# EAGLE schematic axiom_beta_plugin_module_1xHDMI_in_v0.1.a3395842 (EAGLE 7.7.0)
Assembly variants: Beta
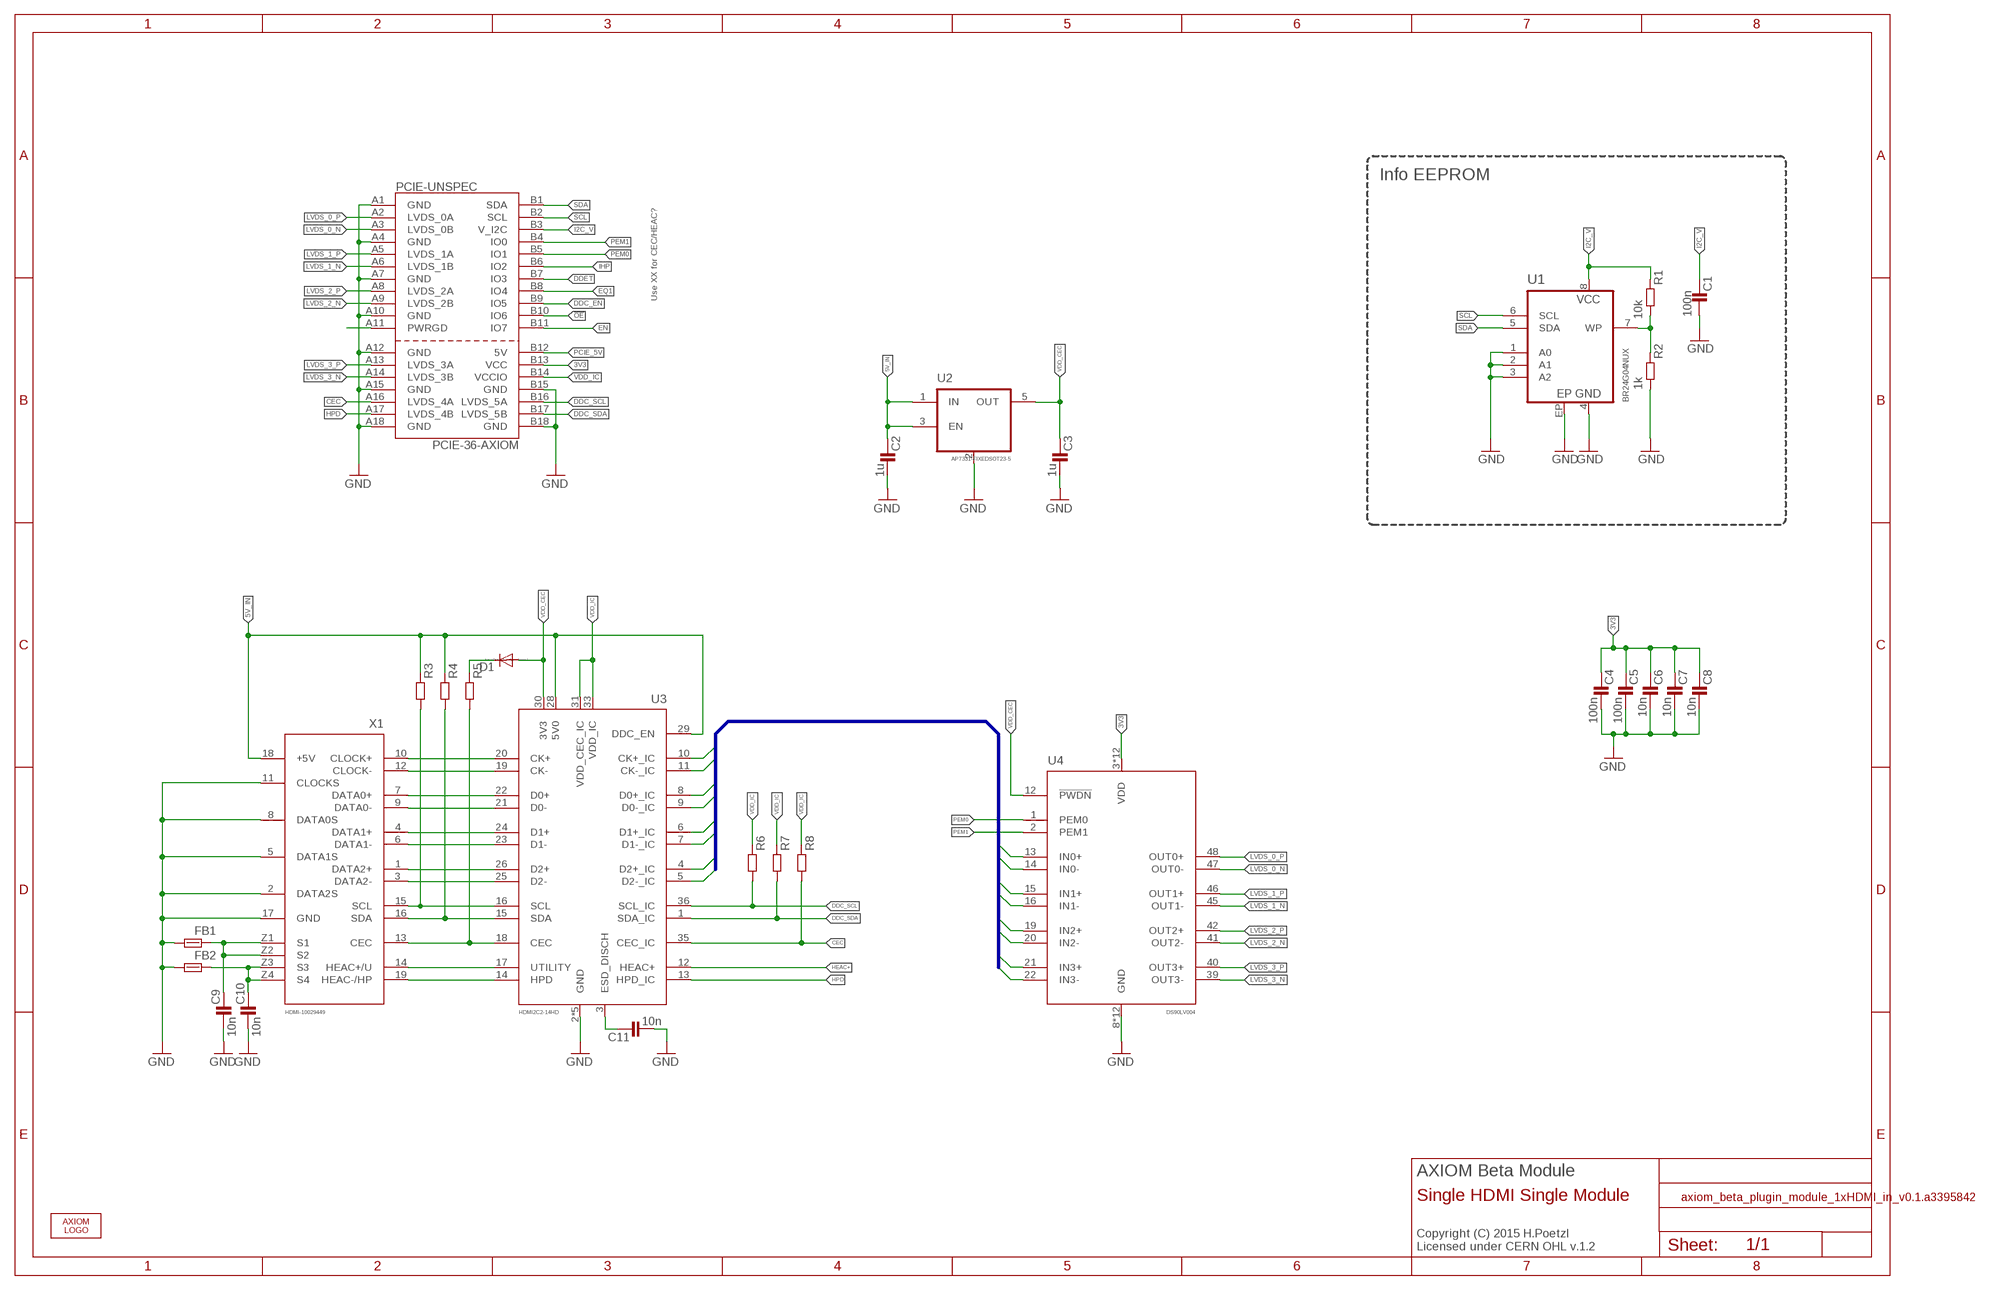
[diagram p0: schematic, sheet 1]

## Parts
C1  100n  C0402-B  [0402-B]
C2  1u  C0402-B  [0402-B]
C3  1u  C0402-B  [0402-B]
C4  100n  C0402-B  [0402-B]
C5  100n  C0402-B  [0402-B]
C6  10n  C0402-B  [0402-B]
C7  10n  C0402-B  [0402-B]
C8  10n  C0402-B  [0402-B]
C9  10n  C0402-B  [0402-B]
C10  10n  C0402-B  [0402-B]
C11  10n  C0402-B  [0402-B]
D1  DIODE-SOD523  [SOD523]
FB1  FB0603-B  [0603-B]
FB2  FB0603-B  [0603-B]
PCIE-UNSPEC  PCIE-36-AXIOM  [PCIE-36-AXIOM]  (not fitted in variant Beta)
R1  10k  R0402-B  [0402-B]
R2  1k  R0402-B  [0402-B]
R3  R0402-B  [0402-B]
R4  R0402-B  [0402-B]
R5  R0402-B  [0402-B]
R6  R0402-B  [0402-B]
R7  R0402-B  [0402-B]
R8  R0402-B  [0402-B]
U1  BR24G04NUX  [DFN200X300X100-9N]
U2  AP7331-FIXEDSOT23-5  [SOT23-5]
U3  HDMI2C2-14HD  [QFN50P650L90W-25N]
U4  DS90LV004  [QFP50P900X900X160-48N]
U$  AXIOM_LOGO459X70  [AXIOM_LOGO_459X70]
X1  HDMI-10029449  [10029449-X01XLF]

## Nets
3V3: C4.1 C5.1 C6.1 C7.1 C8.1 PCIE-UNSPEC.B13(VCC) U4.3(VDD) U4.4(VDD) U4.5(VDD) U4.7(VDD) U4.10(VDD) U4.11(VDD) U4.27(VDD) U4.28(VDD) U4.29(VDD) U4.32(VDD) U4.33(VDD) U4.34(VDD)
5V_IN: C2.1 R3.1 R4.1 U2.1(IN) U2.3(EN) U3.28(5V0) U3.29(DDC_EN) X1.18(+5V)
!OE!: PCIE-UNSPEC.B10(IO6)
CEC: PCIE-UNSPEC.A16(LVDS_4A) R8.2 U3.35(CEC_IC)
CK+: U3.20(CK+) X1.10(CLOCK+)
CK-: U3.19(CK-) X1.12(CLOCK-)
D0+: U3.22(D0+) X1.7(DATA0+)
D0-: U3.21(D0-) X1.9(DATA0-)
D1+: U3.24(D1+) X1.4(DATA1+)
D1-: U3.23(D1-) X1.6(DATA1-)
D2+: U3.26(D2+) X1.1(DATA2+)
D2-: U3.25(D2-) X1.3(DATA2-)
DDC_EN: PCIE-UNSPEC.B9(IO5)
DDC_SCL: PCIE-UNSPEC.B16(LVDS_5A) R6.2 U3.36(SCL_IC)
DDC_SDA: PCIE-UNSPEC.B17(LVDS_5B) R7.2 U3.1(SDA_IC)
DDET: PCIE-UNSPEC.B7(IO3)
EN: PCIE-UNSPEC.B11(IO7)
EQ1: PCIE-UNSPEC.B8(IO4)
GND: C1.2 C2.2 C3.2 C4.2 C5.2 C6.2 C7.2 C8.2 C9.2 C10.2 C11.2 FB1.2 FB2.2 PCIE-UNSPEC.A1(GND) PCIE-UNSPEC.A4(GND) PCIE-UNSPEC.A7(GND) PCIE-UNSPEC.A10(GND) PCIE-UNSPEC.A12(GND) PCIE-UNSPEC.A15(GND) PCIE-UNSPEC.A18(GND) PCIE-UNSPEC.B15(GND) PCIE-UNSPEC.B18(GND) R2.2 U1.1(A0) U1.2(A1) U1.3(A2) U1.4(GND) U1.EP U2.2(GND) U3.2(GND) U3.27(GND) U3.32(GND) U3.34(GND) U3.EP(GND) U4.8(GND) U4.9(GND) U4.17(GND) U4.18(GND) U4.23(GND) U4.24(GND) U4.25(GND) U4.26(GND) U4.37(GND) U4.38(GND) U4.43(GND) U4.44(GND) X1.2(DATA2S) X1.5(DATA1S) X1.8(DATA0S) X1.11(CLOCKS) X1.17(GND)
HEAC+: U3.12(HEAC+)
HPD: PCIE-UNSPEC.A17(LVDS_4B) U3.13(HPD_IC)
I2C_V: C1.1 PCIE-UNSPEC.B3(V_I2C) R1.1 U1.8(VCC)
IHP: PCIE-UNSPEC.B6(IO2)
IN0+: U3.4(D2+_IC) U4.13(IN0+)
IN0-: U3.5(D2-_IC) U4.14(IN0-)
IN1+: U3.6(D1+_IC) U4.15(IN1+)
IN1-: U3.7(D1-_IC) U4.16(IN1-)
IN2+: U3.8(D0+_IC) U4.19(IN2+)
IN2-: U3.9(D0-_IC) U4.20(IN2-)
IN3+: U3.10(CK+_IC) U4.21(IN3+)
IN3-: U3.11(CK-_IC) U4.22(IN3-)
LVDS_0_N: PCIE-UNSPEC.A3(LVDS_0B) U4.47(OUT0-)
LVDS_0_P: PCIE-UNSPEC.A2(LVDS_0A) U4.48(OUT0+)
LVDS_1_N [power]: PCIE-UNSPEC.A6(LVDS_1B) U4.45(OUT1-)
LVDS_1_P [power]: PCIE-UNSPEC.A5(LVDS_1A) U4.46(OUT1+)
LVDS_2_N [power]: PCIE-UNSPEC.A9(LVDS_2B) U4.41(OUT2-)
LVDS_2_P [power]: PCIE-UNSPEC.A8(LVDS_2A) U4.42(OUT2+)
LVDS_3_N [power]: PCIE-UNSPEC.A14(LVDS_3B) U4.39(OUT3-)
LVDS_3_P [power]: PCIE-UNSPEC.A13(LVDS_3A) U4.40(OUT3+)
N$1: R3.2 U3.16(SCL) X1.15(SCL)
N$2: R4.2 U3.15(SDA) X1.16(SDA)
N$3: R5.2 U3.18(CEC) X1.13(CEC)
N$4: U3.17(UTILITY) X1.14(HEAC+/U)
N$5: U3.14(HPD) X1.19(HEAC-/HP)
N$6: C9.1 FB1.1 X1.Z1(S1) X1.Z2(S2)
N$12: R1.2 R2.1 U1.7(WP)
N$15: C10.1 FB2.1 X1.Z3(S3) X1.Z4(S4)
N$17: D1.C R5.1
N$19: C11.1 U3.3(ESD_DISCH)
N$209: PCIE-UNSPEC.A11(PWRGD)
PCIE_5V: PCIE-UNSPEC.B12(5V)
PEM0: PCIE-UNSPEC.B5(IO1) U4.1(PEM0)
PEM1: PCIE-UNSPEC.B4(IO0) U4.2(PEM1)
SCL: PCIE-UNSPEC.B2(SCL) U1.6(SCL)
SDA: PCIE-UNSPEC.B1(SDA) U1.5(SDA)
VDD_CEC: C3.1 D1.A U2.5(OUT) U3.30(3V3) U4.12(!PWDN)
VDD_IC: PCIE-UNSPEC.B14(VCCIO) R6.1 R7.1 R8.1 U3.31(VDD_CEC_IC) U3.33(VDD_IC)

## Buses
IN:IN0+,IN0-,IN1+,IN1-,IN2+,IN2-,IN3+,IN3-

## Notes on the sheet
- Info EEPROM
- Use XX for CEC/HEAC?
- AXIOM Beta Module
- Single HDMI Single Module
- Copyright (C) 2015 H.Poetzl
  Licensed under CERN OHL v.1.2

## Library data of the parts
C1-C11 = generic-rcl:C
D1 = diode:DIODE-: DIODE
FB1 FB2 = generic-rcl:FB
PCIE-UNSPEC = PCIe:PCIE-36-AXIOM
R1-R8 = generic-rcl:R
U1 = eeprom:BR24G04
U2 = ldo:AP7331-FIXED
U3 = hdmi2c2-14hd:HDMI2C2-14HD
U4 = ds90lv004:DS90LV004
U$ = logos_apertus_axiom:AXIOM_LOGO
X1 = hdmi:HDMI

## Net classes
0 default: width 0.152 mm, drill 0.203 mm
1 power: width 0.152 mm, drill 0.203 mm